# EAGLE design WS28Board (EAGLE 9.6.2)
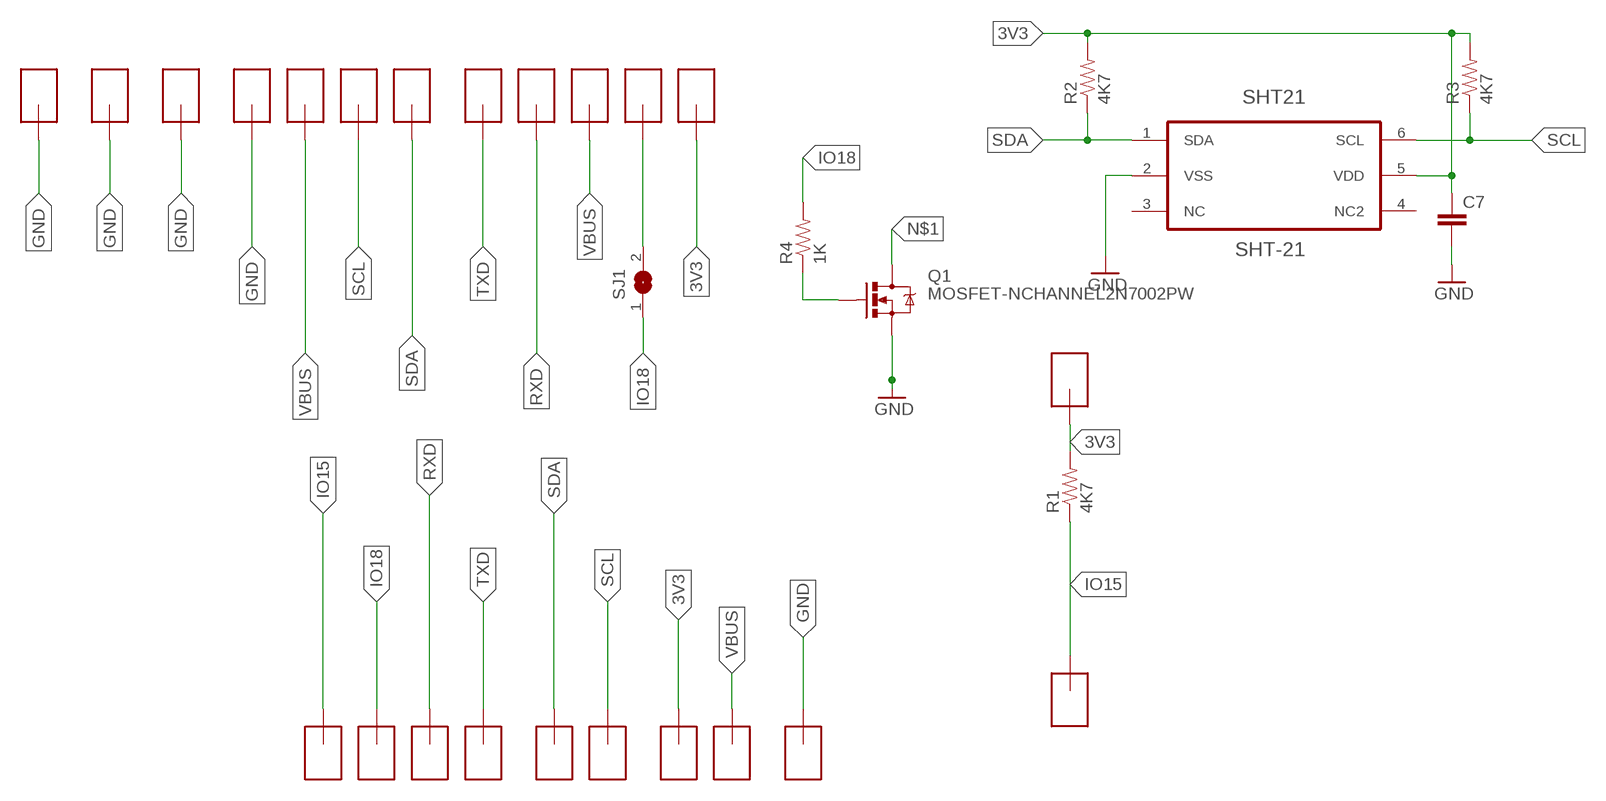
[diagram p0: schematic, sheet 1]

## Parts
C7  CAP0603-CAP  [0603-CAP]
GND  SMD-PAD1  [SMD-PAD1]
GND1  SMD-PAD1  [SMD-PAD1]
GND2  SMD-PAD1  [SMD-PAD1]
GND3  SMD-PAD1  [SMD-PAD1]
GND4  SMD-PAD1  [SMD-PAD1]
Q1  MOSFET-NCHANNEL2N7002PW  [SOT323]
R1  4K7  RESISTOR0805-RES  [0805]
R2  4K7  RESISTOR0805-RES  [0805]
R3  4K7  RESISTOR0805-RES  [0805]
R4  1K  RESISTOR0805-RES  [0805]
SHT21  SHT-21  [SHT21]
SJ1  SJ  [SJ]
U$1  SMD-PAD1  [SMD-PAD1]
U$2  SMD-PAD1  [SMD-PAD1]
U$3  SMD-PAD1  [SMD-PAD1]
U$4  SMD-PAD1  [SMD-PAD1]
U$5  SMD-PAD1  [SMD-PAD1]
U$6  SMD-PAD1  [SMD-PAD1]
U$7  SMD-PAD1  [SMD-PAD1]
U$8  SMD-PAD1  [SMD-PAD1]
U$9  SMD-PAD1  [SMD-PAD1]
U$10  SMD-PAD1  [SMD-PAD1]
U$11  SMD-PAD1  [SMD-PAD1]
U$12  SMD-PAD1  [SMD-PAD1]
U$13  SMD-PAD1  [SMD-PAD1]
U$14  SMD-PAD1  [SMD-PAD1]
U$15  SMD-PAD1  [SMD-PAD1]
U$16  SMD-PAD1  [SMD-PAD1]
U$17  SMD-PAD1  [SMD-PAD1]
U$18  SMD-PAD1  [SMD-PAD1]

## Nets
3V3: C7.1 GND4.>NAME R1.2 R2.2 R3.2 SHT21.5(VDD) U$13.>NAME U$14.>NAME
GND: C7.2 Q1.2(S) SHT21.2(VSS) U$1.>NAME U$10.>NAME U$15.>NAME U$16.>NAME U$17.>NAME
IO15: GND2.>NAME R1.1 U$18.>NAME
IO18: R4.2 SJ1.1 U$9.>NAME
N$1: GND.>NAME Q1.3(D) SJ1.2
N$2: Q1.1(G) R4.1
RXD: U$3.>NAME U$8.>NAME
SCL: R3.1 SHT21.6(SCL) U$6.>NAME U$12.>NAME
SDA: GND1.>NAME GND3.>NAME R2.1 SHT21.1(SDA)
TXD: U$2.>NAME U$7.>NAME
VBUS: U$4.>NAME U$5.>NAME U$11.>NAME
Unconnected: SHT21.4(NC2)

## Power pins joined to a net without a drawn wire
NC: SHT21.3(NC)

## Library data of the parts
C7 = SparkFun-Capacitors:CAP: Capacitor Standard 0603 ceramic capacitor, and 0.1" leaded capacitor.
GND GND1-GND4 U$1-U$18 = CuriousTech:SMD-PAD1: SMD-PAD small
Q1 = SparkFun-DiscreteSemi:MOSFET-NCHANNEL: Common NMOSFET Parts MFG P/N Store ID Prod ID FDD8780 TRANS-09984 SI7820DN TRANS-11055 FDS6630A IC-08089 2N7002PW TRANS-11151 FQP30N06L COM-10213 TRANS-10060 BSS123LT1G TRANS-08345 BSS138 TRANS-00830 BS170 2N7000; PROD_ID: TRANS-11151
R1-R4 = SparkFun-Resistors:RESISTOR: Resistor Basic schematic elements and footprints for 0603, 1206, and PTH resistors.
SHT21 = CuriousTech:SHT-21
SJ1 = jumper:SJ: SMD solder JUMPER

## Board
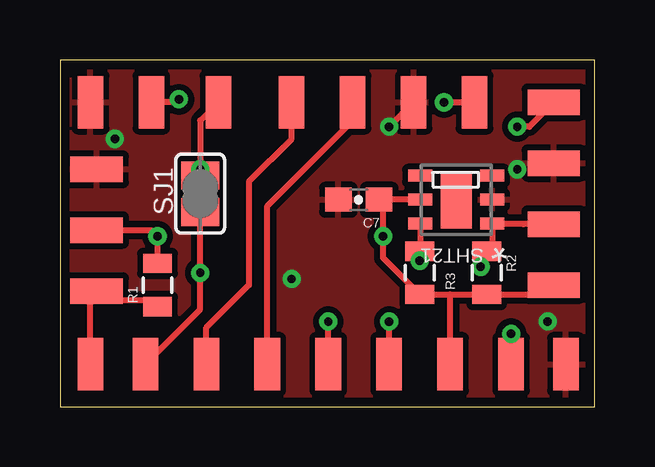
[diagram p1: board, top side]
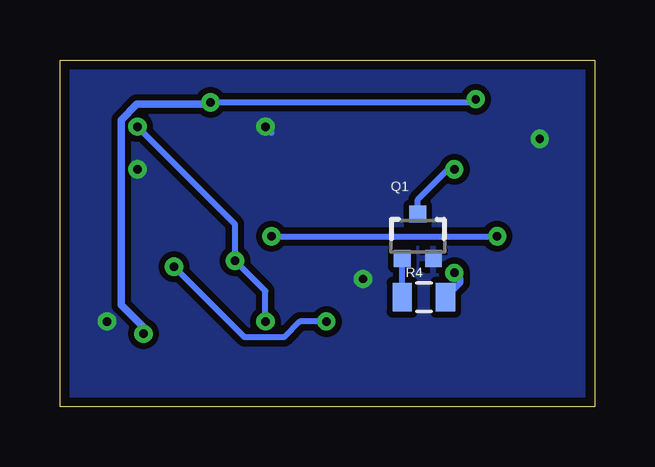
[diagram p2: board, bottom side, seen from below]

Size 22.28 x 14.47 mm. Coordinates in mm from the lower left corner, seen from the top.
Outline: 0,0 22.28,0 22.28,14.47 0,14.47 0,0
Copper layers (1*16): Top 0.035mm / dielectric 1.5mm / Bottom 0.035mm
Design rules "default *": minimum track width 6mil, minimum drill 0.35mm, track to track 6mil, track to pad 6mil, pad to pad 6mil, via to via 6mil, smd to smd 6mil, copper to edge 15mil, drill to drill 6mil, minimum pad ring 10mil, minimum via ring 8mil, stop-mask expansion 4mil, vias tented up to drill 0mil, thermal gap 10mil

### Footprints (pad centres in the part's own frame; a part is rotated, then mirrored left to right if it is on the bottom)
0603-CAP = smd 1.1 x 1: 1 -0.85,0; 2 0.85,0
SMD-PAD1 = smd 2.184 x 1.067: >NAME 0,0
SOT323 = smd 0.7 x 0.7: 1 -0.65,-0.925; 2 0.65,-0.925; 3 0,0.925
0805 = smd 0.8 x 1.2: 1 -0.9,0; 2 0.9,0
SHT21 = smd 1 x 0.5: 1 -1.5,1; 2 -1.5,0; 3 -1.5,-1; 4 1.5,-1; 5 1.5,0; 6 1.5,1 | smd 1.3 x 2.4: P$1 0,0
SJ = smd 1.168 x 1.6: 1 -0.762,0; 2 0.762,0

### Placement (x,y rotation side)
C7  12.45,8.64 180 top
GND  6.6,12.7 90 top
GND1  11.18,1.78 90 top
GND2  1.27,1.78 270 top
GND3  20.57,7.62 180 top
GND4  1.52,7.37 0 top
Q1  7.37,7.11 0 bottom
R1  4.06,5.08 90 top
R2  17.78,5.59 270 top
R3  14.99,5.59 270 top
R4  7.11,4.57 0 bottom
SHT21  16.51,8.64 180 top
SJ1  5.84,8.89 90 top
U$1  21.08,1.78 90 top
U$2  8.64,1.78 90 top
U$3  6.1,1.78 90 top
U$4  17.27,12.7 90 top
U$5  18.8,1.78 90 top
U$6  13.72,1.78 90 top
U$7  12.19,12.7 90 top
U$8  9.65,12.7 90 top
U$9  3.56,1.78 90 top
U$10  20.57,10.16 180 top
U$11  3.81,12.7 90 top
U$12  20.57,12.7 180 top
U$13  16.26,1.78 90 top
U$14  20.57,5.08 180 top
U$15  1.27,12.7 90 top
U$16  1.52,9.91 0 top
U$17  14.73,12.7 90 top
U$18  1.52,4.83 0 top

### Tracks (layer width: path | path; a pad name or v marks a point on that pad's centre or on a via)
3V3  (via drill 0.35)
  Top 0.254: GND4.>NAME 3.81,7.37 v4.06,7.11 R1.2 | 16.26,4.69 R3.2 13.46,6.21 13.46,6.86 13.46,8.64 | 16.26,4.69 R2.2 20.18,4.69 U$14.>NAME | U$13.>NAME 16.26,4.69 | SHT21.5 13.46,8.64 | 13.46,8.64 C7.1
  Top 0.305: v13.46,7.11 13.46,6.86
  Bottom 0.254: v13.46,7.11 v4.06,7.11
GND  (via drill 0.35)
  Top 0.254: U$17.>NAME v13.72,11.68
  Bottom 0.254: v13.72,11.68 13.46,11.43
  other vias: 19.05,9.91 9.65,5.33 20.32,3.56 2.29,11.18
  pour Top (isolate 0.254): 0,0 0,14.48 22.35,14.48 22.35,0
  pour Bottom (isolate 0.254): 0,0 0,14.48 22.35,14.48 22.35,0
IO15
  Top 0.254: GND2.>NAME 1.27,4.43 1.92,4.43 | R1.1 3.81,4.43 1.92,4.43 | U$18.>NAME 1.92,4.43
IO18  (via drill 0.35)
  Top 0.254: U$9.>NAME 5.84,4.06 v5.84,5.59 SJ1.1
  Bottom 0.254: R4.2 5.59,5.2 5.59,5.33 v5.84,5.59
N$1  (via drill 0.35)
  Top 0.254: GND.>NAME 5.84,11.94 v5.84,9.91 SJ1.2
  Bottom 0.254: Q1.3 7.37,8.64 6.1,9.91 v5.84,9.91
N$2
  Bottom 0.254: R4.1 Q1.1
RXD
  Top 0.254: U$3.>NAME 6.1,3.3 7.87,5.08 7.87,9.4 9.65,11.18 U$8.>NAME
SCL  (via drill 0.35)
  Top 0.254: SHT21.6 15.01,6.53 | 15.01,6.53 R3.1 | v14.99,6.1 14.99,6.5 15.01,6.53 | U$6.>NAME v13.72,3.56 | U$12.>NAME 19.56,11.68 v19.05,11.68
  Bottom 0.254: v13.72,3.56 13.72,4.83 v14.99,6.1 14.99,7.62 v19.05,11.68
SDA  (via drill 0.35)
  Top 0.254: GND3.>NAME 19.3,7.62 19.28,7.64 SHT21.1 18.01,6.73 R2.1 17.53,6.23 v17.53,5.84 | GND1.>NAME v11.18,3.56
  Bottom 0.254: v11.18,3.56 12.28,3.56 12.94,2.9 14.58,2.9 v17.53,5.84
TXD
  Top 0.254: U$7.>NAME 12.19,11.94 8.64,8.38 U$2.>NAME
VBUS  (via drill 0.35)
  Top 0.254: v16,12.7 U$4.>NAME | v4.95,12.83 4.83,12.7 U$11.>NAME
  Top 0.305: U$5.>NAME v18.8,3.05
  Bottom 0.254: v16,12.7 5.08,12.7 v4.95,12.83
  Bottom 0.305: v16,12.7 16.08,12.62 19.08,12.62 19.73,11.97 19.73,4.24 18.8,3.3 v18.8,3.05